# Altium schematic sheet DC-DC-Converters.SchDoc
size A3
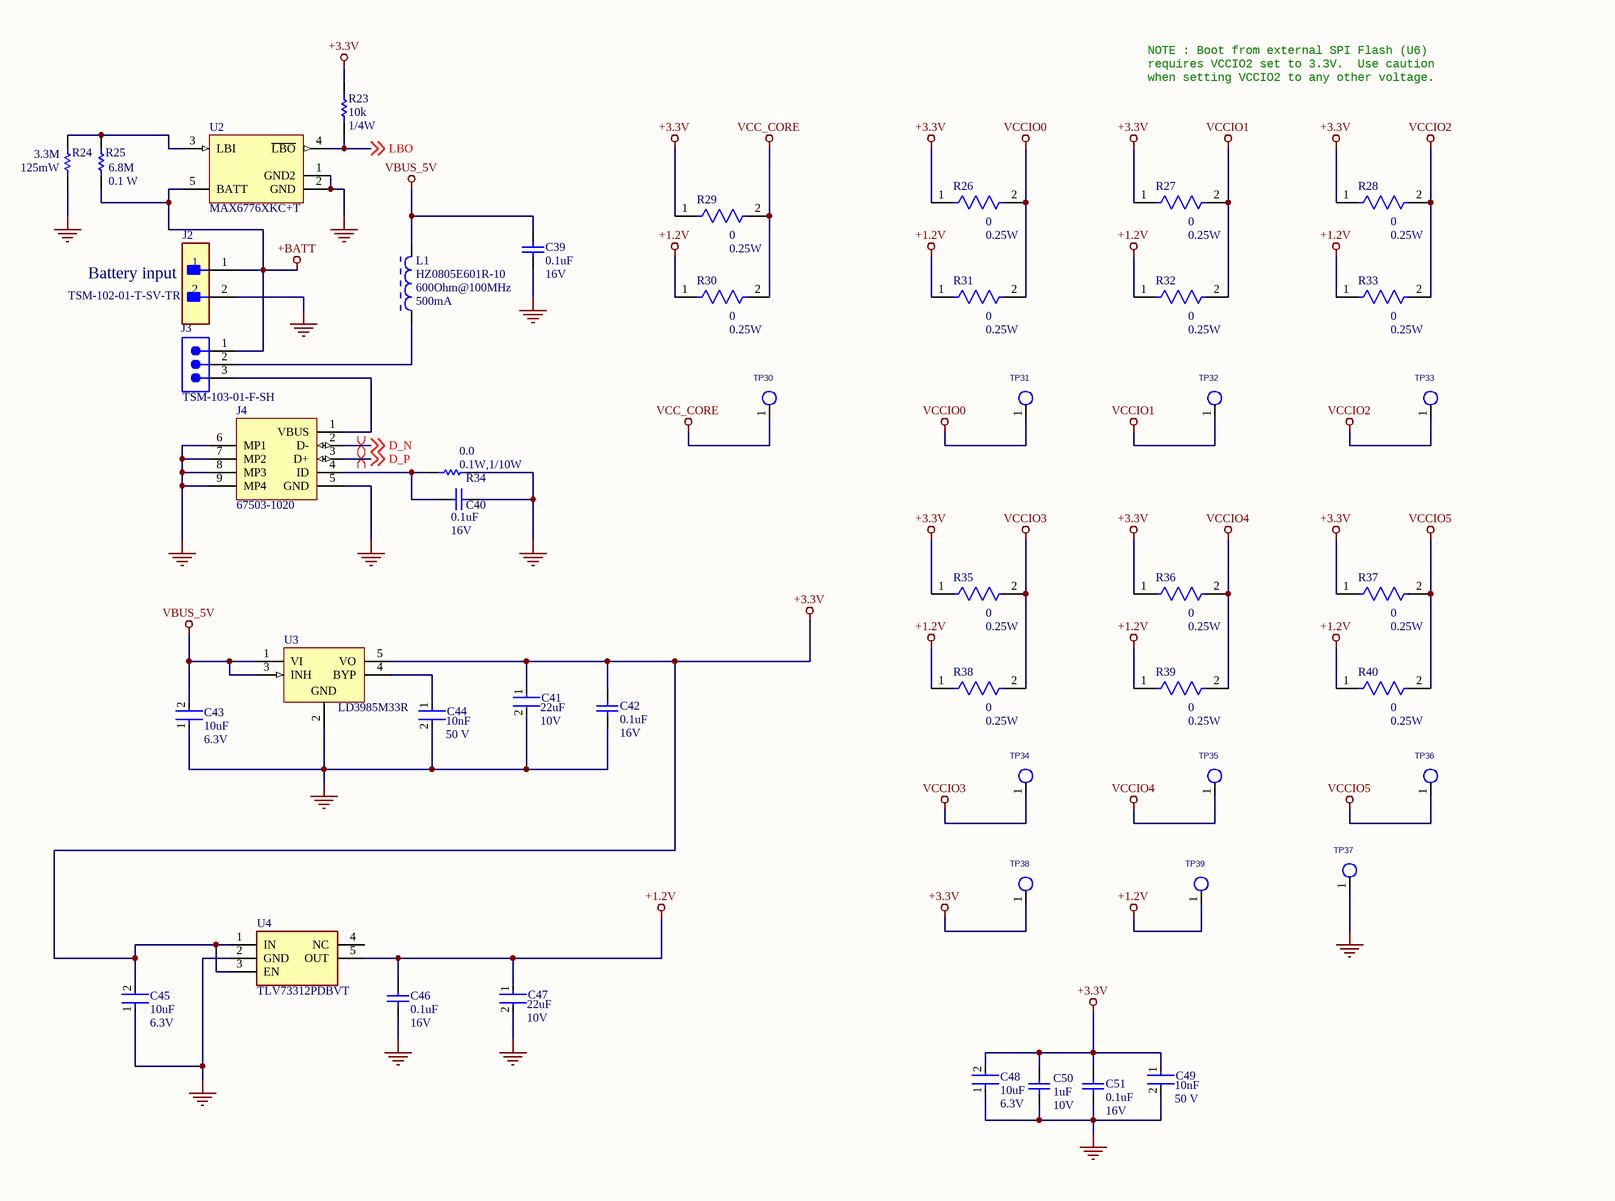
[diagram p0: DC-DC-Converters.SchDoc]

## Parts
C39  value 0.1uF  Voltage: 16V  [CAPC1608X87X35ML15T15]  (hidden comment: C0603C104M4RACTU)
C40  value 0.1uF  Voltage: 16V  [CAPC1608X87X35ML15T15]  (hidden comment: C0603C104M4RACTU)
C41  value 22uF  Voltage: 10V  [FP-GRM188-0_2-IPC_C]  (hidden comment: GRM188R61A226ME15D)
C42  value 0.1uF  Voltage: 16V  [CAPC1608X87X35ML15T15]  (hidden comment: C0603C104M4RACTU)
C43  value 10uF  Voltage: 6.3V  [FP-CL10-IPC_C]  (hidden comment: CL10A106MQ8NNNC)
C44  value 10nF  Voltage: 50 V  [FP-C0805C-DN-MFG]  (hidden comment: C0805C103K5RACAUTO)
C45  value 10uF  Voltage: 6.3V  [FP-CL10-IPC_C]  (hidden comment: CL10A106MQ8NNNC)
C46  value 0.1uF  Voltage: 16V  [CAPC1608X87X35ML15T15]  (hidden comment: C0603C104M4RACTU)
C47  value 22uF  Voltage: 10V  [FP-GRM188-0_2-IPC_C]  (hidden comment: GRM188R61A226ME15D)
C48  value 10uF  Voltage: 6.3V  [FP-CL10-IPC_C]  (hidden comment: CL10A106MQ8NNNC)
C49  value 10nF  Voltage: 50 V  [FP-C0805C-DN-MFG]  (hidden comment: C0805C103K5RACAUTO)
C50  value 1uF  Voltage: 10V  [CAPC1608X90X35ML15T15]  (hidden comment: C0603C105K8RACTU)
C51  value 0.1uF  Voltage: 16V  [CAPC1608X87X35ML15T15]  (hidden comment: C0603C104M4RACTU)
J2  TSM-102-01-T-SV-TR  [FP-TSM-102-01-T-SV-TR-MFG]
J3  TSM-103-01-F-SH  [SMTC-TSM-103-01-X-SH-A]
J4  67503-1020  [MOLX-67503-1020_V]
L1  HZ0805E601R-10  Impedance @ Frequency: 600Ohm@100MHz  Current Rating (Max): 500mA  [LIRD-LI0805H151R-10-2_V]
R23  value 10k  Power: 1/4W  [RESC3216X70X50NL05T20]  (hidden comment: ERJ-8GEYJ103V)
R24  value 3.3M  Power: 125mW  [RESC2013X50X30LL20T20]  (hidden comment: CRCW08053M30FKEA)
R25  value 6.8M  Power: 0.1 W  [RESC0603(1608)_L]  (hidden comment: 6M8 5% 0603(1608))
R26  value 0  Power: 0.25W  [FP-RC1206-MFG]  (hidden comment: RC1206JR-070RL)
R27  value 0  Power: 0.25W  [FP-RC1206-MFG]  (hidden comment: RC1206JR-070RL)
R28  value 0  Power: 0.25W  [FP-RC1206-MFG]  (hidden comment: RC1206JR-070RL)
R29  value 0  Power: 0.25W  [FP-RC1206-MFG]  (hidden comment: RC1206JR-070RL)
R30  value 0  Power: 0.25W  [FP-RC1206-MFG]  (hidden comment: RC1206JR-070RL)
R31  value 0  Power: 0.25W  [FP-RC1206-MFG]  (hidden comment: RC1206JR-070RL)
R32  value 0  Power: 0.25W  [FP-RC1206-MFG]  (hidden comment: RC1206JR-070RL)
R33  value 0  Power: 0.25W  [FP-RC1206-MFG]  (hidden comment: RC1206JR-070RL)
R34  value 0.0  Power: 0.1W,1/10W  [RESC1608X55X35LL10T10]  (hidden comment: RC1608J000CS)
R35  value 0  Power: 0.25W  [FP-RC1206-MFG]  (hidden comment: RC1206JR-070RL)
R36  value 0  Power: 0.25W  [FP-RC1206-MFG]  (hidden comment: RC1206JR-070RL)
R37  value 0  Power: 0.25W  [FP-RC1206-MFG]  (hidden comment: RC1206JR-070RL)
R38  value 0  Power: 0.25W  [FP-RC1206-MFG]  (hidden comment: RC1206JR-070RL)
R39  value 0  Power: 0.25W  [FP-RC1206-MFG]  (hidden comment: RC1206JR-070RL)
R40  value 0  Power: 0.25W  [FP-RC1206-MFG]  (hidden comment: RC1206JR-070RL)
TP30  tp_s_40_63  [tp_s_40_63]  (value not drawn)
TP31  tp_s_40_63  [tp_s_40_63]  (value not drawn)
TP32  tp_s_40_63  [tp_s_40_63]  (value not drawn)
TP33  tp_s_40_63  [tp_s_40_63]  (value not drawn)
TP34  tp_s_40_63  [tp_s_40_63]  (value not drawn)
TP35  tp_s_40_63  [tp_s_40_63]  (value not drawn)
TP36  tp_s_40_63  [tp_s_40_63]  (value not drawn)
TP37  tp_s_40_63  [tp_s_40_63]  (value not drawn)
TP38  tp_s_40_63  [tp_s_40_63]  (value not drawn)
TP39  tp_s_40_63  [tp_s_40_63]  (value not drawn)
U2  MAX6776XKC+T  [X5+1_N]
U3  LD3985M33R  [SOT23-5L_N]
U4  TLV73312PDBVT  [SOT95P280X145-5N]

## Nets
+1.2V: C46.1 C47.1 R30.1 R31.1 R32.1 R33.1 R38.1 R39.1 R40.1 TP39.1(TP) U4.5(OUT)
+3.3V: C41.1 C42.1 C45.2 C48.2 C49.1 C50.2 C51.1 R23.1 R26.1 R27.1 R28.1 R29.1 R35.1 R36.1 R37.1 TP38.1(TP) U3.5(VO) U4.1(IN) U4.3(EN)
+BATT: J2.1 J3.1 R25.1 U2.5(BATT)
GND: C39.2 C40.1 C41.2 C42.2 C43.1 C44.2 C45.1 C46.2 C47.2 C48.1 C49.2 C50.1 C51.2 J2.2 J4.5(GND) J4.6(MP1) J4.7(MP2) J4.8(MP3) J4.9(MP4) R24.1 R34.2 TP37.1(TP) U2.1(GND2) U2.2(GND) U3.2(GND) U4.2(GND)
VBUS_5V: C39.1 C43.2 L1.2 U3.1(VI) U3.3(INH)
VCC_CORE: R29.2 R30.2 TP30.1(TP)
VCCIO0: R26.2 R31.2 TP31.1(TP)
VCCIO1: R27.2 R32.2 TP32.1(TP)
VCCIO2: R28.2 R33.2 TP33.1(TP)
VCCIO3: R35.2 R38.2 TP34.1(TP)
VCCIO4: R36.2 R39.2 TP35.1(TP)
VCCIO5: R37.2 R40.2 TP36.1(TP)
D_N: J4.2(D-) ; off-sheet D_N
D_P: J4.3(D+) ; off-sheet D_P
LBO: R23.2 U2.4(~{LBO}) ; off-sheet LBO
NetC40_2: C40.2 J4.4(ID) R34.1
NetC44_1: C44.1 U3.4(BYP)
NetJ3_2: J3.2 L1.1
NetJ3_3: J3.3 J4.1(VBUS)
NetR24_2: R24.2 R25.2 U2.3(LBI)

Not connected (* = marked no-connect by the designer): U4 4(NC)

## Layout directives
differential pair; differential pair class USB; rule Differential Pairs Routing [Pref Gap = 10mil    Min Gap  = 10mil    Max Gap  = 10milPref Width = 14.334mil    Min Width  = 14.334mil    Max Width  = 15mil]: D_N, D_P

## Notes on the sheet
- NOTE : Boot from external SPI Flash (U6)
  requires VCCIO2 set to 3.3V.  Use caution
  when setting VCCIO2 to any other voltage.
- (near J2) Battery input
- Title
- Size:
- Date:
- A3
- Number:
- Time:
- Revision:
- Sheet
- of
- File:

## Library data of the parts
C39 C40 C42 C46 C51 = CMP-2006-03067-1: Ceramic Capacitor 0.1uF 16V +-10% X7R0603; Manufacturer: Kemet; Alternative1: C1608X7R1E104K TDK; Alternative2: CC0603KRX7R8BB104 Yageo; Alternative3: GRM188R72A104KA35D Murata; Part Number: C0603C104M4RACTU; Package / Case: 0603
C41 C47 = CMP-06035-000033-2: Chip Multilayer Ceramic Capacitors for General Purpose, 0603, 22uF, X5R, 15%, 20%, 10V; Alternative1: GRM21BR72A103KA01L Murata; Alternative2: C0805F103K5RACTU KEMET; Alternative3: 08055C103JAT2A Kyocera AVX; Tolerance: 20%; Material: Ceramic; Termination: SMD/SMT; Packaging: Tape and Reel; Width: 0.8mm; Case Code (Imperial): 0603; Mount: Surface Mount; Package / Case: 0603; Dielectric: X5R; Package Quantity: 4000; Case Code (Metric): 1608; Min Operating Temperature: -55°C; Lead Free: Lead Free; Max Operating Temperature: 85°C; Part Number: GRM188R61A226ME15D
C43 C45 C48 = CMP-13271-001938-1: Cap Ceramic 10uF 6.3V X5R ±20% Pad SMD 0603 +85°C T/R; Manufacturer: Samsung; Alternative1: LMK107BJ106MALTD Taiyo Yuden; Alternative2: C1608X5R0J106K080AB TDK; Alternative3: 06036D106MAT2A Kyocera AVX; Height: 0.8mm; Width: 0.031inch; Min Operating Temperature: -55°C; Dielectric: X5R; Package / Case: 0603; Radiation Hardening: No; Packaging: Tape and Reel; Max Operating Temperature: 85°C; Thickness: 0.035inch; Mount: Surface Mount; Case Code (Imperial): 0603; Case Code (Metric): 1608; Depth: 0.8mm; Tolerance: 20%; Length: 1.6mm; Part Number: CL10A106MQ8NNNC
C44 C49 = CMP-03020-006206-1: CAP CER 10000PF 50V X7R 0805; Manufacturer: KEMET; Material: Ceramic; Temperature Coefficient: 30ppm/°C; Alternative1: GRM21BR72A103KA01L Murata; Alternative2: C0805F103K5RACTU KEMET; Alternative3: 08055C103JAT2A Kyocera AVX; Height: 0.88mm; Temperature Characteristic: X7R; Part Number: C0805C103K5RACAUTO; ComponentLink2URL: https://content.kemet.com/datasheets/KEM_C1003_C0G_SMD.pdf; RoHS: TRUE; Temperature: -55°C to +125°C; Temperature Range Low: -55°C; ComponentLink2Description: Datasheet; Package / Case: C0805C-DN; Lead Free: Yes
C50 = CMP-2006-02293-1: Manufacturer: Kemet; Alternative1: CL10B105KO8NNND Samsung; Alternative2: CC0603KPX7R7BB105 Yageo; Alternative3: GRM188R71C105KE15D Murata; Part Number: C0603C105K8RACTU; Package / Case: 0603
J2 = CMP-02766-000113-1: CONN HEADER SMD 2POS 2.54MM; Gender: Male; Max Voltage Rating (AC): 475V; Number of Contacts: 2; Max Current Rating: 7A; Contact Material: Bronze; Min Operating Temperature: -55°C; REACH SVHC: No SVHC; Housing Material: Polymer; Lead Free: Lead Free; Orientation: Straight; Radiation Hardening: No; Number of Rows: 1; Length: 5.08mm; Housing Color: Black; Max Operating Temperature: 105°C; Contact Plating: Tin; Depth: 2.54mm; Packaging: Tape and Reel; Pitch: 2.54mm; Termination: Solder
J3 = CMP-1024-00212-1: 0.025" SQ Post Header, Surface Mount, Horizontal, -55 to 125 degC, 2.54 mm Pitch, 3-Pin, Male, RoHS; Manufacturer: Samtec; Pitch: 2.54 mm; ComponentLink1Description: Manufacturer URL; Temperature Range: -55 to 125 degC; Part Number: TSM-103-01-F-SH; Orientation: Horizontal; ComponentLink1URL: http://www.samtec.com; ComponentLink2Description: Datasheet; Mounting Technology: Surface Mount; RoHS: True; ComponentLink3URL: http://www.samtec.com/documents/webfiles/cpdf/TSM-1XX-XX-XXX-SH-XX-XXX-XX-MKT1.pdf; ComponentLink3Description: Package Specification; ComponentLink2URL: http://www.samtec.com/documents/webfiles/pdf/TSM.PDF
J4 = CMP-0411-00002-1: USB, MINI, SMD, RA KME04-USBMU03A01; Manufacturer: Molex; ComponentLink1URL: http://www.molex.com/; Part Number: 67503-1020; Mounting Technology: Surface Mount; ComponentLink1Description: Manufacturer URL; Terminal Pitch: 0.8 mm; DatasheetVersion: Rev F, 06/2009; ComponentLink2Description: Datasheet; PackageDescription: Mini USB Connector, SMT, Righer Angle; ComponentLink2URL: http://www.molex.com/pdm_docs/sd/675031020_sd.pdf; PackageReference: 67503-1020
L1 = CMP-2000-05194-1: Chip Bead for Signal Filtering, 600 Ohm, 500 mA, -40 to 125 degC, 0805 (2012 Metric), RoHS, Tape and Reel; Manufacturer: Laird; Other Names: 240-2399-1; Kits: 240-2227-ND-KITEMIFERRITEBEADCHIPSMD; DC Resistance (DCR) (Max): 300mOhm; Filter Type: SignalLine; Operating Temperature: -40degC~125degC; Datasheet URL: https://datasheet.ciiva.com/22622/1685710-22622833.pdf; Mounting Type: SurfaceMount; Package / Case: 0805(2012Metric); Package Description: 2-Pin Surface Mount Device, Body 2 x 1.25 mm; Package Reference: LI0805H15R-10-2; Size / Dimension: 0.079"Lx0.049"W(2.00mmx1.25mm); Height (Max): 0.043"(1.10mm); Part Number: HZ0805E601R-10
R23 = CMP-2003-00545-1: Res Thick Film 1206 10k Ohms 5% 1/4W; Manufacturer: Panasonic; Alternative1: CR1206F-10KFI TT Welwyn; Alternative2: WR12X1002FGL Walsin Technologies; Alternative3: CR1206-FX-1002ELF Bourns; Part Number: ERJ-8GEYJ103V; Package / Case: 1206
R24 = CMP-2001-03892-1: Manufacturer: Vishay Dale; Alternative1: CRCW08050000Z0EA Vishay; Alternative2: CRCW080512K0FKEA Vishay; Alternative3: CRCW08054K70FKEA Vishay; Part Number: CRCW08053M30FKEA; Package / Case: 0805
R25 = CMP-1012-00166-1: 6M8 0.1W 5% 0603 (1608 Metric)  SMD; Part Number: ERJ-3GEYJ685V; Alternative1: CR0603-JW-685ELF; Alternative2: RMCF0603JT6M80 Stackpole Electronics; Alternative3: CRCW06036M80JNEA Vishay Dale; Package / Case: 0603; Tolerance: 5 %
R26-R33 R35-R40 = CMP-03412-007570-1: RES SMD 0 OHM JUMPER 1/4W 1206; Manufacturer: YAGEO; Voltage Rating: 200V; Temperature Coefficient: 300ppm/°C; Tolerance: 5%; Alternative1: RC1206JR-100R Yageo; Alternative2: ERJ8GEY0R00V Panasonic; Alternative3: CRCW12060000Z0EC Vishay Dale; Part Number: RC1206JR-070RL; Temperature: -55°C to +155°C; ComponentLink2URL: https://www.yageo.com/upload/media/product/productsearch/datasheet/rchip/PYu-RC_Group_51_RoHS_L_10.pdf; Lead Free: Yes; Height: 0.65mm; Package / Case: 1206; ComponentLink2Description: Datasheet; Composition: Thick Film; RoHS: TRUE
R34 = CMP-2000-06972-1: Chip Resistor, 0 Ohm, +/- 5%, 0.1 W, -55 to 155 degC, 0603 (1608 Metric), RoHS, Tape and Reel; Manufacturer: Samsung-Electro-Mechanics-America,-Inc.; Tolerance: Jumper; Alternative1: RC0603JR-130RL Yageo; Alternative2: RC0603JR-100RL Yageo; Alternative3: CRCW0603-0000Z0EA Vishay; Manufacturer URL: http://www.samsungsem.com/global/index.jsp; Features: MoistureResistant; Mounting Technology: SurfaceMount; Series: RC; Package / Case: 0603(1608Metric); Category: Resistors; Operating Temperature: -55°C~155°C; Datasheet URL: http://static6.arrow.com/aropdfconversion/3cece72dd289ffbadc164fbcd05f638dd7240f7b/rc_datasheet_150330.pdf.pdf?authToken=eyJ0eXAiOiJKV1QiLCJhbGciOiJIUzI1NiJ9.eyJTZXNzaW9uSWQiOiJtY3ZlYXdxYmptZXdpdXdyeG1ha2FxdWciLCJEb3dubG9hZFR5cGUiOiJEYXRhc2hlZXRzIiwiaXNzIjoic2VsZiIsImF1ZCI6Imh0dHA6Ly9kYXRhc2hlZXRhdXRoLmFycm93LmNvbSIsImV4cCI6MTQ3Njg1OTQ5NiwibmJmIjoxNDc2ODU5Mzc2fQ.1rZWSrRNyHkP6J5YmszFzS2kzmlbN9BKNvWJ4ACiP-Q; Datasheet Version: 09/2015; Composition: ThickFilm; Package Description: 2-Pin Chip Resistor, Body 1.6 x 0.8 mm; Height: 0.022"(0.55mm); Family: ChipResistor-SurfaceMount; Temperature Coefficient: -; Size / Dimension: 0.063"Lx0.031"W(1.60mmx0.80mm); Part Number: RC1608J000CS
TP30-TP39 = TP_S_40_63: Square test point, 40mil inner diameter, 63mil outer diameter; Assy: DNI; Class: IO
U2 = CMP-0251-00617-1: Low-Power, 1%-Accurate Battery Monitor, Single LBO output, Open-Drain output, Fixed hysteresis, 5-Pin SC70, -40°C to +85°C, Pb-Free, Tape and Reel; PackageVersion: revE, 2006; PackageDescription: 5-Pin SC70 Transistor Package, 0.65 mm Pitch, 2.2 mm Lead Span; ComponentLink1URL: http://www.maxim-ic.com; ComponentLink2URL: http://datasheets.maxim-ic.com/en/ds/MAX6775-MAX6781.pdf; ComponentLink2Description: Datasheet; ComponentLink3URL: http://pdfserv.maxim-ic.com/package_dwgs/21-0076.PDF; ComponentLink1Description: Manufacturer URL; ComponentLink3Description: Package Specification; PackageReference: X5+1; DatasheetVersion: Rev 4, May-2009; Code_JEDEC: MO-203
U3 = CMP-0244-00328-1: 150mA, Ultra-Low Drop Low Noise BiCMOS Voltage Regulators Low ESR Capacitors Compatible, 3.3V, 5-Pin SOT23-5L; ComponentLink1Description: Manufacturer URL; ComponentLink2URL: http://www.st.com/internet/com/TECHNICAL_RESOURCES/TECHNICAL_LITERATURE/DATASHEET/CD00003395.pdf; PackageReference: SOT23-5L; ComponentLink1URL: http://www.st.com; ComponentLink2Description: Datasheet; PackageVersion: 1/01/2008; PackageDescription: 5-Pin SOT-23 Package, 2.9 x 1.6 mm Body, 0.95 mm Pitch, 2.8 mm Lead Span; DatasheetVersion: 3/01/2011
U4 = TLV73312PDBVT: Integrated Circuit; Manufacturer_Name: Texas Instruments; Datasheet Link: http://www.ti.com/lit/gpn/TLV733P; Height: 1.45mm; Manufacturer_Part_Number: TLV73312PDBVT; Arrow Part Number: TLV73312PDBVT; Arrow Price/Stock: https://www.arrow.com/en/products/tlv73312pdbvt/texas-instruments; Mouser Part Number: 595-TLV73312PDBVT; Mouser Price/Stock: https://www.mouser.co.uk/ProductDetail/Texas-Instruments/TLV73312PDBVT?qs=ifm8N2KdrcbA2G38xADqCw%3D%3D